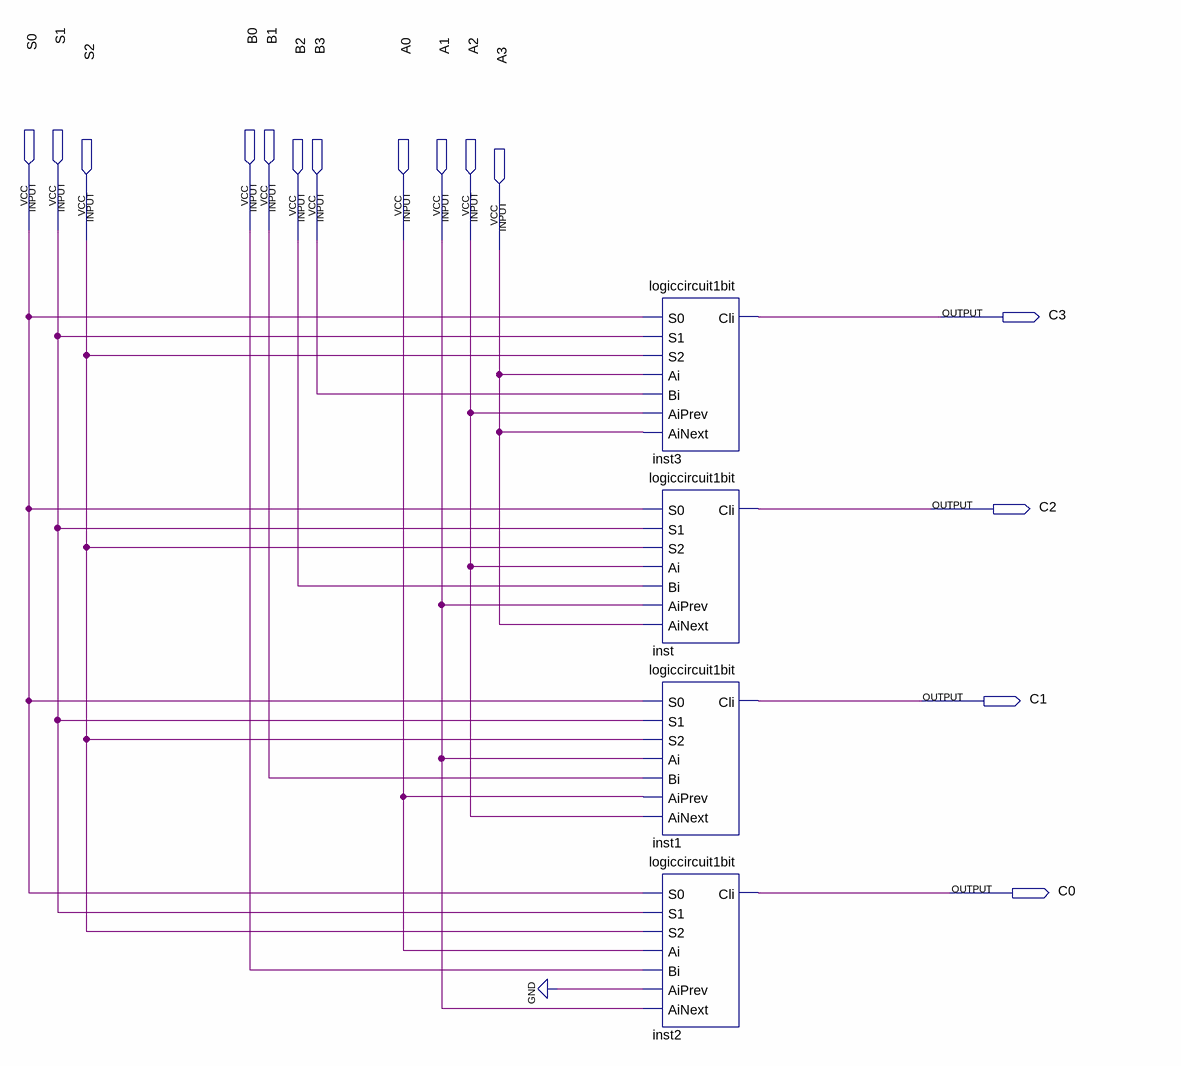
[diagram p0: schematic sheet]
// Quartus schematic logiccircuit4bits.bdf as structural Verilog: 4 symbols, 15 pins
module logiccircuit4bits (
  input  S0,
  input  S1,
  input  B0,
  input  B1,
  input  S2,
  input  B2,
  input  B3,
  input  A0,
  input  A1,
  input  A2,
  input  A3,
  output C3,
  output C2,
  output C1,
  output C0
);

  logiccircuit1bit inst3 (.S0(S0), .S1(S1), .S2(S2), .Ai(A3), .Bi(B3), .AiPrev(A2), .AiNext(A3), .Cli(C3));
  logiccircuit1bit inst (.S0(S0), .S1(S1), .S2(S2), .Ai(A2), .Bi(B2), .AiPrev(A1), .AiNext(A3), .Cli(C2));
  logiccircuit1bit inst1 (.S0(S0), .S1(S1), .S2(S2), .Ai(A1), .Bi(B1), .AiPrev(A0), .AiNext(A2), .Cli(C1));
  logiccircuit1bit inst2 (.S0(S0), .S1(S1), .S2(S2), .Ai(A0), .Bi(B0), .AiPrev(1'b0), .AiNext(A1), .Cli(C0));
endmodule
